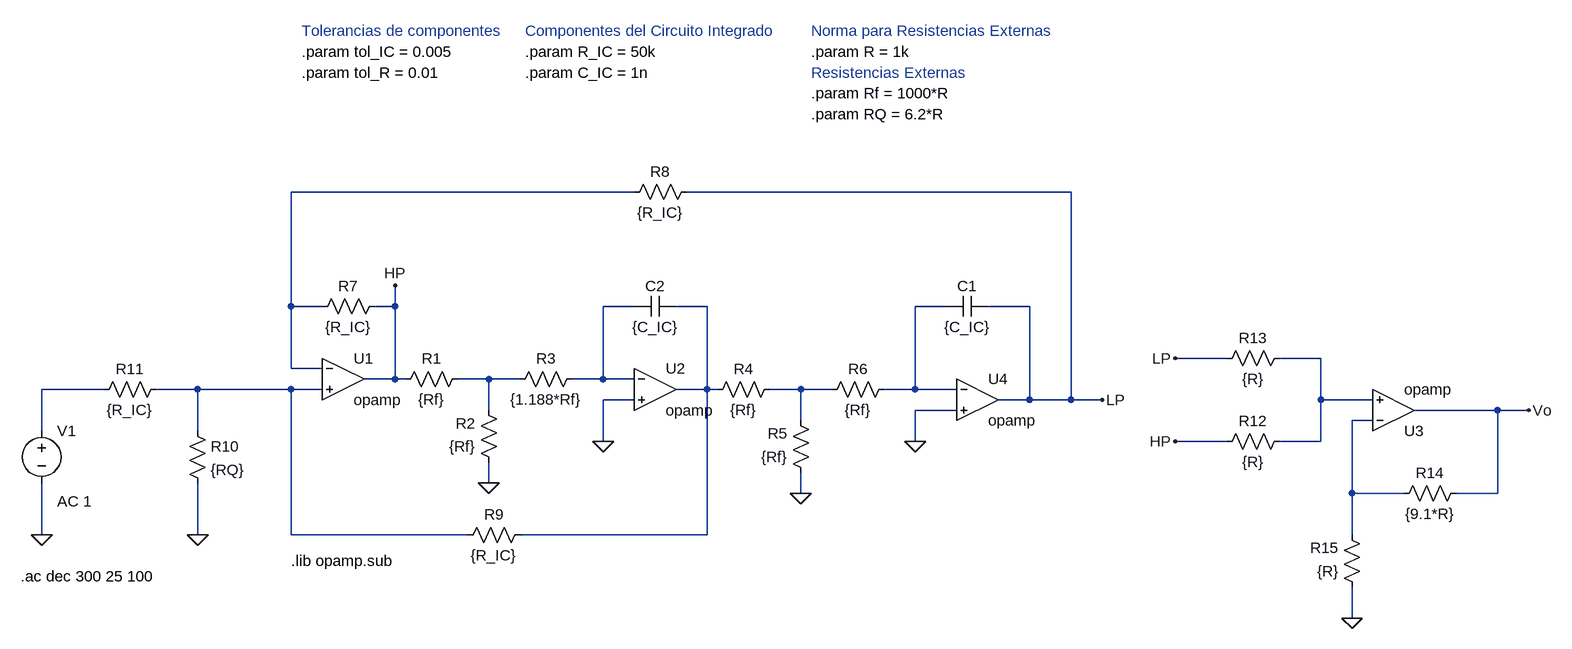
[diagram p0: schematic Notch_sin_uaf42.asc]
Notch_sin_uaf42.asc, the LTspice schematic file:
Version 4
SHEET 1 2068 704
WIRE 560 -176 32 -176
WIRE 1232 -176 640 -176
WIRE 32 0 32 -176
WIRE 80 0 32 0
WIRE 192 0 192 -32
WIRE 192 0 160 0
WIRE 560 0 512 0
WIRE 672 0 624 0
WIRE 1040 0 992 0
WIRE 1168 0 1104 0
WIRE 1472 80 1392 80
WIRE 1616 80 1552 80
WIRE 32 96 32 0
WIRE 80 96 32 96
WIRE 192 112 192 0
WIRE 192 112 144 112
WIRE 208 112 192 112
WIRE 336 112 288 112
WIRE 384 112 336 112
WIRE 512 112 512 0
WIRE 512 112 464 112
WIRE 560 112 512 112
WIRE -256 128 -352 128
WIRE -112 128 -176 128
WIRE 32 128 -112 128
WIRE 80 128 32 128
WIRE 672 128 672 0
WIRE 672 128 624 128
WIRE 688 128 672 128
WIRE 816 128 768 128
WIRE 864 128 816 128
WIRE 992 128 992 0
WIRE 992 128 944 128
WIRE 1056 128 992 128
WIRE 560 144 512 144
WIRE 1168 144 1168 0
WIRE 1168 144 1120 144
WIRE 1232 144 1232 -176
WIRE 1232 144 1168 144
WIRE 1280 144 1232 144
WIRE 1616 144 1616 80
WIRE 1696 144 1616 144
WIRE 336 160 336 112
WIRE 1056 160 992 160
WIRE 1888 160 1760 160
WIRE 1936 160 1888 160
WIRE 816 176 816 128
WIRE 1696 176 1664 176
WIRE -352 192 -352 128
WIRE -112 192 -112 128
WIRE 512 208 512 144
WIRE 992 208 992 160
WIRE 1472 208 1392 208
WIRE 1616 208 1616 144
WIRE 1616 208 1552 208
WIRE 336 272 336 240
WIRE 816 288 816 256
WIRE 1664 288 1664 176
WIRE 1744 288 1664 288
WIRE 1888 288 1888 160
WIRE 1888 288 1824 288
WIRE -352 352 -352 272
WIRE -112 352 -112 272
WIRE 32 352 32 128
WIRE 304 352 32 352
WIRE 672 352 672 128
WIRE 672 352 384 352
WIRE 1664 352 1664 288
WIRE 1664 480 1664 432
FLAG 816 288 0
FLAG 336 272 0
FLAG 512 208 0
FLAG 992 208 0
FLAG -112 352 0
FLAG -352 352 0
FLAG 192 -32 HP
FLAG 1280 144 LP
FLAG 1392 80 LP
FLAG 1392 208 HP
FLAG 1664 480 0
FLAG 1936 160 Vo
SYMBOL OpAmps\\opamp 112 48 R0
SYMATTR InstName U1
SYMBOL OpAmps\\opamp 592 64 R0
SYMATTR InstName U2
SYMBOL OpAmps\\opamp 1088 80 R0
SYMATTR InstName U4
SYMBOL res 304 96 R90
WINDOW 0 0 56 VBottom 2
WINDOW 3 32 56 VTop 2
SYMATTR InstName R1
SYMATTR Value {Rf}
SYMBOL res 352 256 R180
WINDOW 0 36 76 Left 2
WINDOW 3 36 40 Left 2
SYMATTR InstName R2
SYMATTR Value {Rf}
SYMBOL res 368 128 R270
WINDOW 0 32 56 VTop 2
WINDOW 3 0 56 VBottom 2
SYMATTR InstName R3
SYMATTR Value {1.188*Rf}
SYMBOL res 784 112 R90
WINDOW 0 0 56 VBottom 2
WINDOW 3 32 56 VTop 2
SYMATTR InstName R4
SYMATTR Value {Rf}
SYMBOL res 832 272 R180
WINDOW 0 36 76 Left 2
WINDOW 3 36 40 Left 2
SYMATTR InstName R5
SYMATTR Value {Rf}
SYMBOL res 848 144 R270
WINDOW 0 32 56 VTop 2
WINDOW 3 0 56 VBottom 2
SYMATTR InstName R6
SYMATTR Value {Rf}
SYMBOL cap 1104 -16 R90
WINDOW 0 0 32 VBottom 2
WINDOW 3 32 32 VTop 2
SYMATTR InstName C1
SYMATTR Value {C_IC}
SYMBOL cap 624 -16 R90
WINDOW 0 0 32 VBottom 2
WINDOW 3 32 32 VTop 2
SYMATTR InstName C2
SYMATTR Value {C_IC}
SYMBOL res 176 -16 R90
WINDOW 0 0 56 VBottom 2
WINDOW 3 32 56 VTop 2
SYMATTR InstName R7
SYMATTR Value {R_IC}
SYMBOL res 656 -192 R90
WINDOW 0 0 56 VBottom 2
WINDOW 3 32 56 VTop 2
SYMATTR InstName R8
SYMATTR Value {R_IC}
SYMBOL res 400 336 R90
WINDOW 0 0 56 VBottom 2
WINDOW 3 32 56 VTop 2
SYMATTR InstName R9
SYMATTR Value {R_IC}
SYMBOL res -128 176 R0
SYMATTR InstName R10
SYMATTR Value {RQ}
SYMBOL res -160 112 R90
WINDOW 0 0 56 VBottom 2
WINDOW 3 32 56 VTop 2
SYMATTR InstName R11
SYMATTR Value {R_IC}
SYMBOL voltage -352 176 R0
WINDOW 123 24 124 Left 2
WINDOW 39 0 0 Left 0
SYMATTR Value2 AC 1
SYMATTR InstName V1
SYMATTR Value ""
SYMBOL res 1568 192 R90
WINDOW 0 0 56 VBottom 2
WINDOW 3 32 56 VTop 2
SYMATTR InstName R12
SYMATTR Value {R}
SYMBOL res 1568 64 R90
WINDOW 0 0 56 VBottom 2
WINDOW 3 32 56 VTop 2
SYMATTR InstName R13
SYMATTR Value {R}
SYMBOL OpAmps\\opamp 1728 224 M180
SYMATTR InstName U3
SYMBOL res 1840 272 R90
WINDOW 0 0 56 VBottom 2
WINDOW 3 32 56 VTop 2
SYMATTR InstName R14
SYMATTR Value {9.1*R}
SYMBOL res 1680 448 R180
WINDOW 0 36 76 Left 2
WINDOW 3 36 40 Left 2
SYMATTR InstName R15
SYMATTR Value {R}
TEXT 32 392 Left 2 !.lib opamp.sub
TEXT -384 416 Left 2 !.ac dec 300 25 100
TEXT 48 -360 Left 2 !.param tol_R = 0.01
TEXT 48 -392 Left 2 !.param tol_IC = 0.005
TEXT 48 -424 Left 2 ;Tolerancias de componentes
TEXT 392 -424 Left 2 ;Componentes del Circuito Integrado
TEXT 392 -392 Left 2 !.param R_IC = 50k
TEXT 392 -360 Left 2 !.param C_IC = 1n
TEXT 832 -424 Left 2 ;Norma para Resistencias Externas
TEXT 832 -392 Left 2 !.param R = 1k
TEXT 832 -360 Left 2 ;Resistencias Externas
TEXT 832 -328 Left 2 !.param Rf = 1000*R
TEXT 832 -296 Left 2 !.param RQ = 6.2*R

The netlist it stands for:
* Notch_sin_uaf42.asc
XU1 N001 N008 HP opamp Aol=100K GBW=10Meg  ; pins invin noninvin out
XU2 N002 0 N003 opamp Aol=100K GBW=10Meg  ; pins invin noninvin out
XU4 N004 0 LP opamp Aol=100K GBW=10Meg  ; pins invin noninvin out
R1 N006 HP {Rf}
R2 0 N006 {Rf}
R3 N006 N002 {1.188*Rf}
R4 N009 N003 {Rf}
R5 0 N009 {Rf}
R6 N009 N004 {Rf}
C1 LP N004 {C_IC}
C2 N003 N002 {C_IC}
R7 HP N001 {R_IC}
R8 LP N001 {R_IC}
R9 N003 N008 {R_IC}
R10 N008 0 {RQ}
R11 N008 N007 {R_IC}
V1 N007 0 AC 1
R12 N005 HP {R}
R13 N005 LP {R}
XU3 N010 N005 Vo opamp Aol=100K GBW=10Meg  ; pins invin noninvin out
R14 Vo N010 {9.1*R}
R15 0 N010 {R}
.lib opamp.sub
.ac dec 300 25 100
.param tol_R = 0.01
.param tol_IC = 0.005
* Tolerancias de componentes
* Componentes del Circuito Integrado
.param R_IC = 50k
.param C_IC = 1n
* Norma para Resistencias Externas
.param R = 1k
* Resistencias Externas
.param Rf = 1000*R
.param RQ = 6.2*R
.backanno
.end